# EAGLE board OASIS-Board (EAGLE 9.6.2)
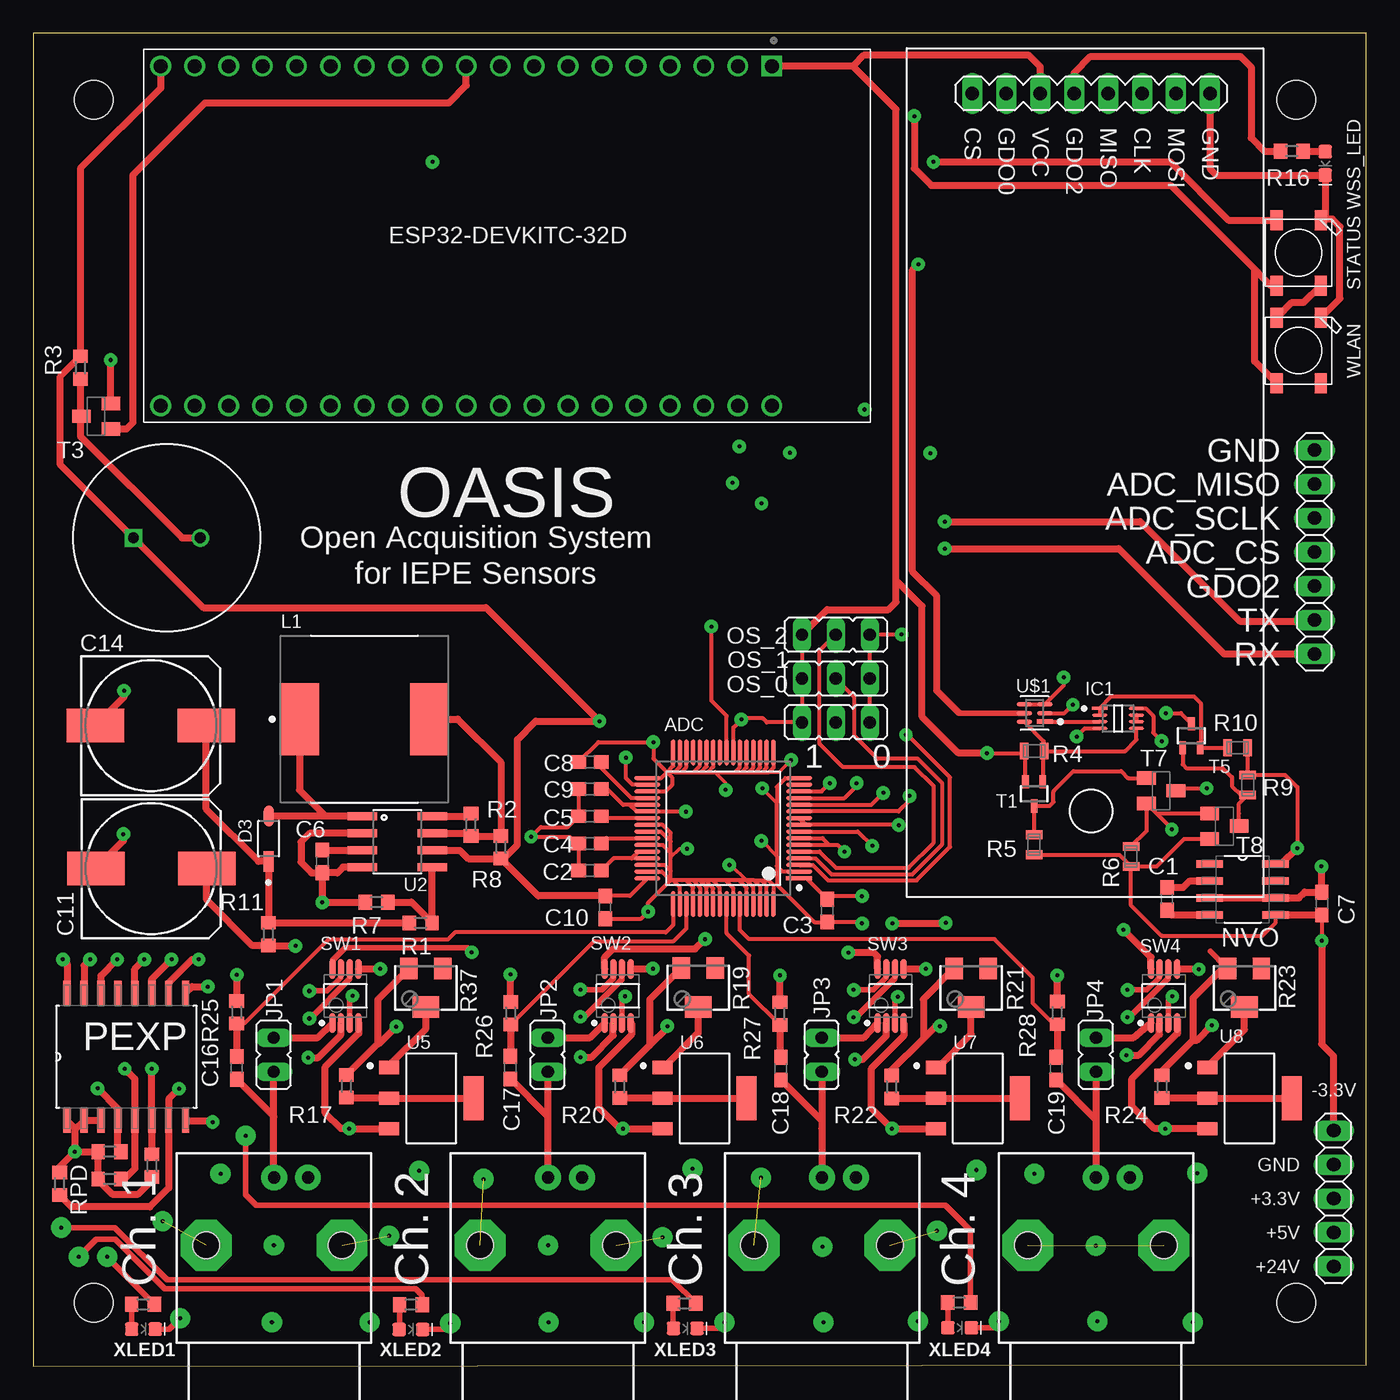
[diagram p2: board, top side]
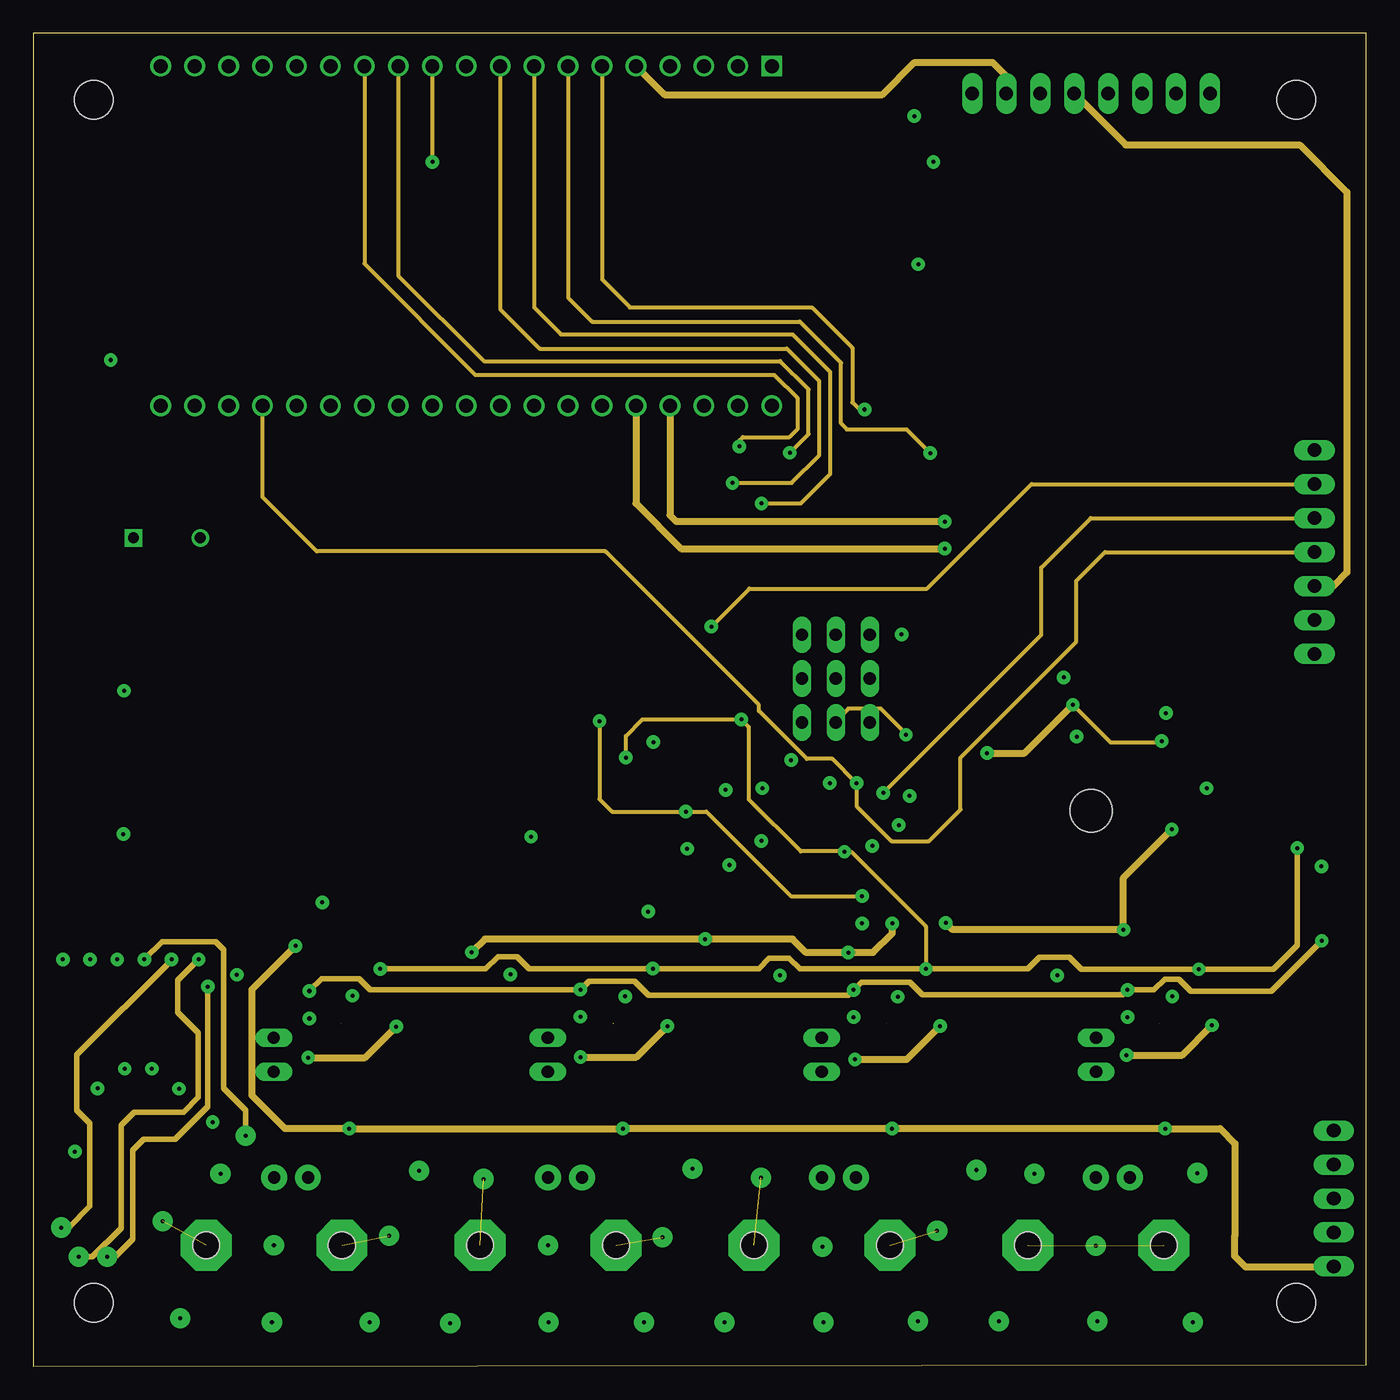
[diagram p3: board, inner layer Route2]
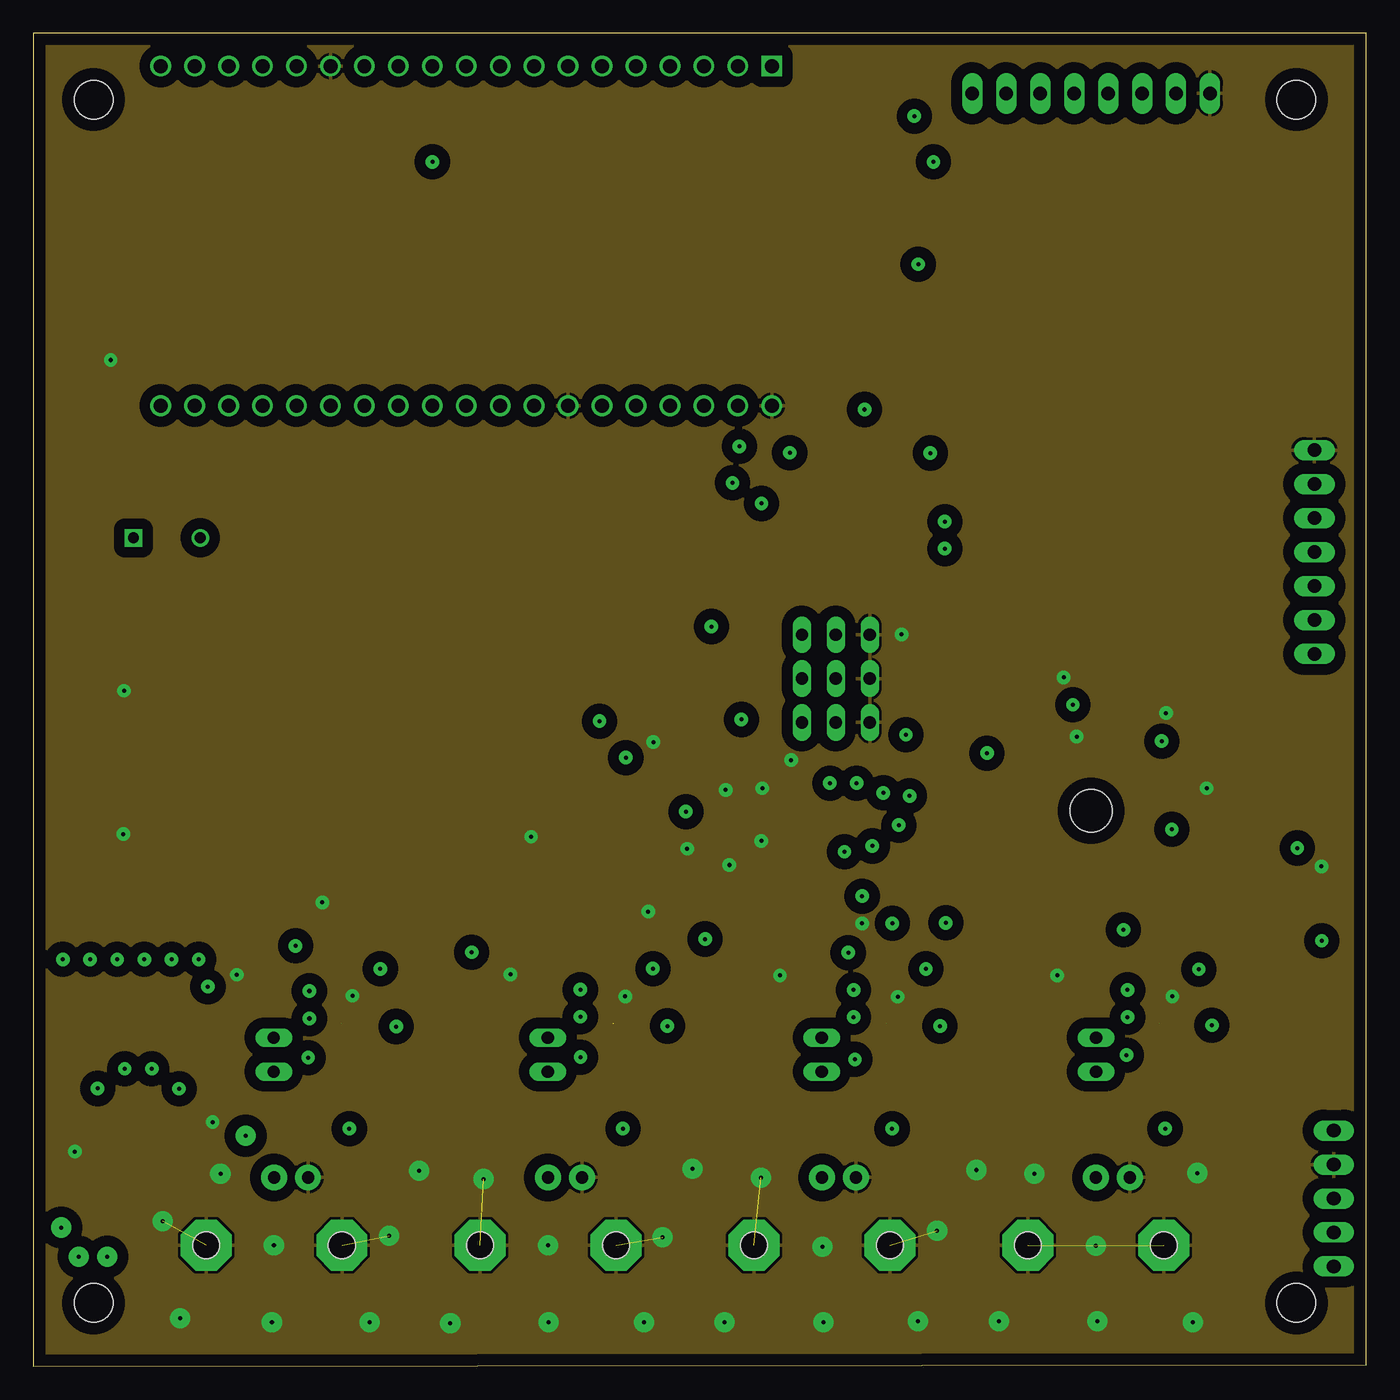
[diagram p4: board, inner layer Ground]
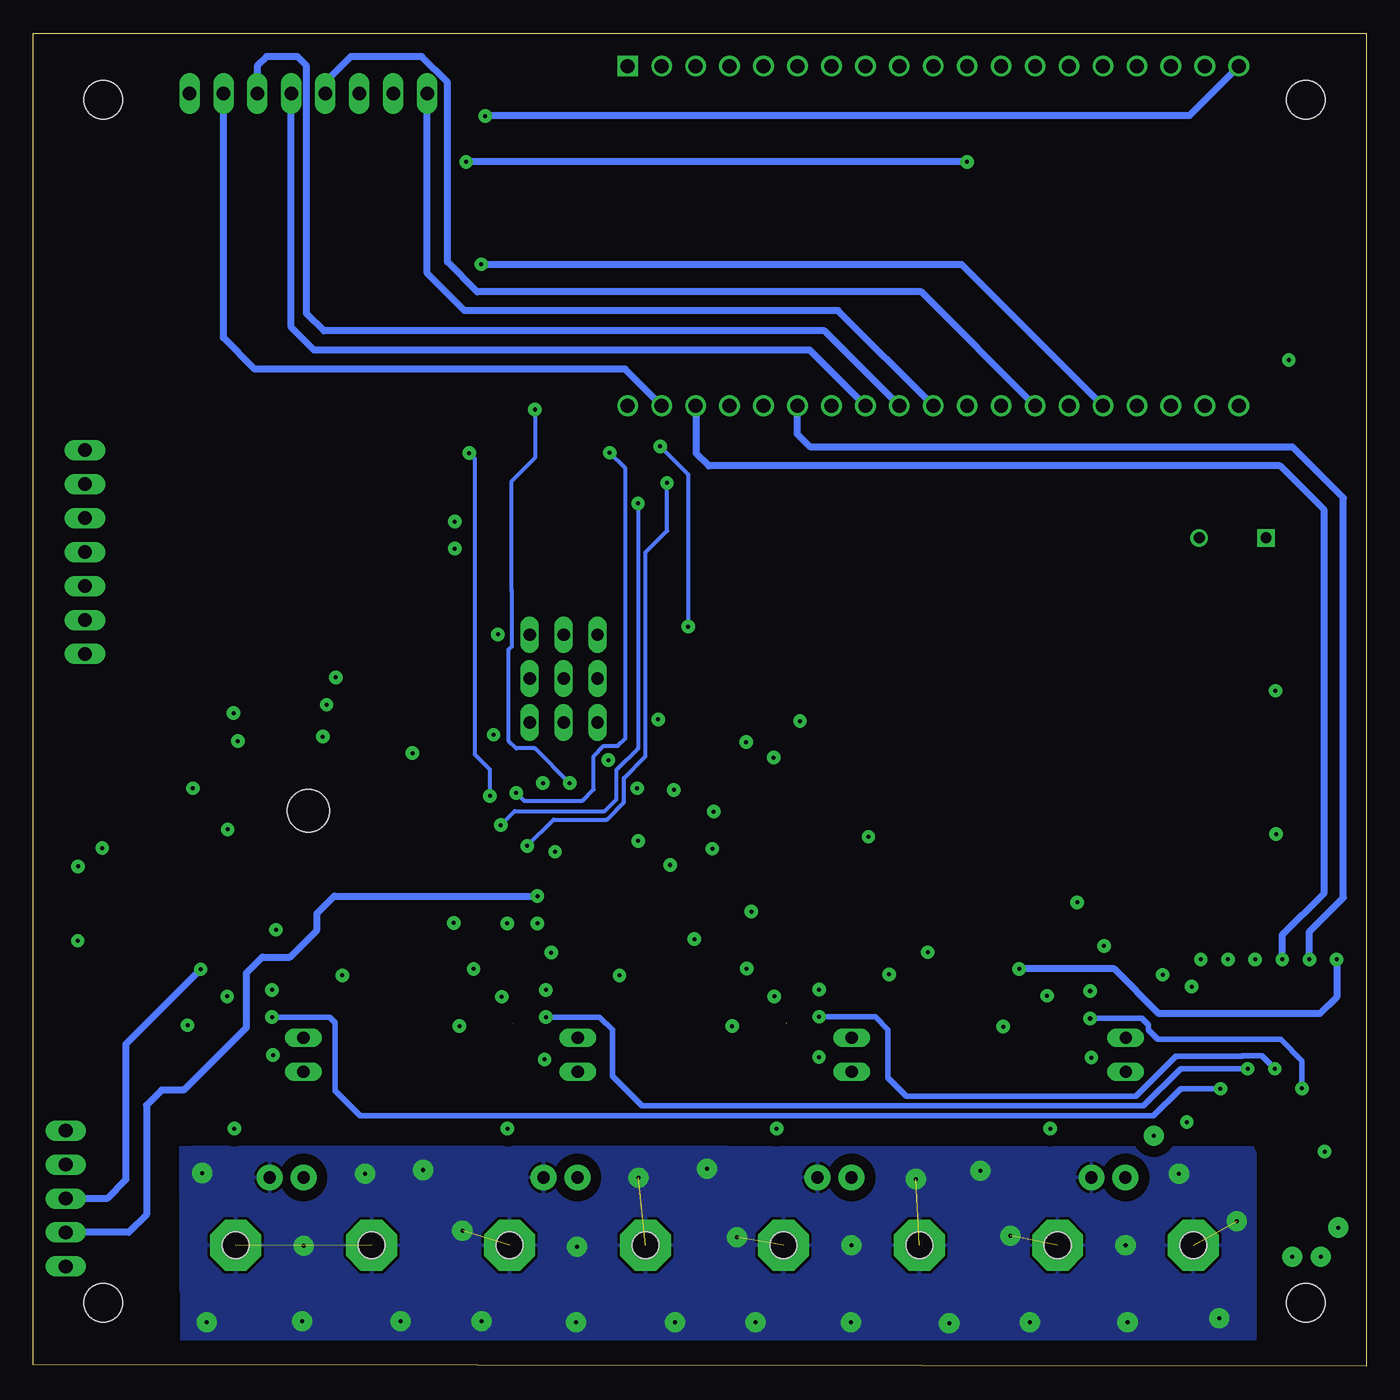
[diagram p5: board, bottom side, seen from below]

Size 99.71 x 99.69 mm. Coordinates in mm from the lower left corner, seen from the top.
Outline: 0,0 99.71,0.12 99.71,99.69 0,99.69 0,0
Copper layers (1*2+3*16): Top 0.035mm / dielectric 0.15mm / Route2 0.035mm / dielectric 0.15mm / Ground 0.035mm / dielectric 0.15mm / Bottom 0.035mm
Design rules "default *": minimum track width 5mil, minimum drill 0.15mm, track to track 4mil, track to pad 4mil, pad to pad 4mil, via to via 4mil, smd to smd 4mil, copper to edge 35mil, drill to drill 10mil, minimum pad ring 5mil, minimum via ring 5mil, stop-mask expansion 8mil, vias tented up to drill 5mil, thermal gap 8mil
Net classes: 1 gnd: width 0.254 mm, drill 0.254 mm, clearance 0.178 mm
Holes 2.9 mm at 94.5,4.74 94.5,94.74 4.5,4.74 4.5,94.74
Holes 3.17 mm at 79.13,41.55

## Footprints (pad centres in the part's own frame; a part is rotated, then mirrored left to right if it is on the bottom)
ANALOG_DEVICES_AD7606-4_0 = smd 1.955 x 0.312: 1 -5.675,3.75; 2 -5.675,3.25; 3 -5.675,2.75; 4 -5.675,2.25; 5 -5.675,1.75; 6 -5.675,1.25; 7 -5.675,0.75; 8 -5.675,0.25; 9 -5.675,-0.25; 10 -5.675,-0.75; 11 -5.675,-1.25; 12 -5.675,-1.75; 13 -5.675,-2.25; 14 -5.675,-2.75; 15 -5.675,-3.25; 16 -5.675,-3.75; 33 5.675,-3.75; 34 5.675,-3.25; 35 5.675,-2.75; 36 5.675,-2.25; 37 5.675,-1.75; 38 5.675,-1.25; 39 5.675,-0.75; 40 5.675,-0.25; 41 5.675,0.25; 42 5.675,0.75; 43 5.675,1.25; 44 5.675,1.75; 45 5.675,2.25; 46 5.675,2.75; 47 5.675,3.25; 48 5.675,3.75 | smd 0.312 x 1.955: 17 -3.75,-5.675; 18 -3.25,-5.675; 19 -2.75,-5.675; 20 -2.25,-5.675; 21 -1.75,-5.675; 22 -1.25,-5.675; 23 -0.75,-5.675; 24 -0.25,-5.675; 25 0.25,-5.675; 26 0.75,-5.675; 27 1.25,-5.675; 28 1.75,-5.675; 29 2.25,-5.675; 30 2.75,-5.675; 31 3.25,-5.675; 32 3.75,-5.675; 49 3.75,5.675; 50 3.25,5.675; 51 2.75,5.675; 52 2.25,5.675; 53 1.75,5.675; 54 1.25,5.675; 55 0.75,5.675; 56 0.25,5.675; 57 -0.25,5.675; 58 -0.75,5.675; 59 -1.25,5.675; 60 -1.75,5.675; 61 -2.25,5.675; 62 -2.75,5.675; 63 -3.25,5.675; 64 -3.75,5.675
C0603 = smd 1.1 x 1: 1 -0.85,0; 2 0.85,0
153CLV-1012 = smd 4.3 x 2.5: + 4.15,0; - -4.15,0
DIODES_1N5819HW-7-F_1 = smd 1.557 x 0.742: 1 -1.7,0; 2 1.7,0
TEXAS_INSTRUMENTS_SN74LVC2G00DCUT_2 = smd 1.16 x 0.237: 1 -1.376,0.75; 2 -1.376,0.25; 3 -1.376,-0.25; 4 -1.376,-0.75; 5 1.376,-0.75; 6 1.376,-0.25; 7 1.376,0.25; 8 1.376,0.75
JP1 = drill 0.914 long: 1 0,-1.27; 2 0,1.27
1X05 = drill 1.016 long: 1 -5.08,0; 2 -2.54,0; 3 0,0; 4 2.54,0; 5 5.08,0
1X07 = drill 1.016 long: 1 -7.62,0; 2 -5.08,0; 3 -2.54,0; 4 0,0; 5 2.54,0; 6 5.08,0; 7 7.62,0
BOURNS_SRR1260-470M_0 = smd 2.9 x 5.4: 1 -4.85,0; 2 4.85,0
TDK_PS1420P02CT_0 = drill 0.8 pad 1.3 square: 1 -2.5,0 | drill 0.8 pad 1.3: 2 2.5,0
SOIC127P600X175-8N = smd 1.981 x 0.559: 1 -2.464,1.905; 2 -2.464,0.635; 3 -2.464,-0.635; 4 -2.464,-1.905; 5 2.464,-1.905; 6 2.464,-0.635; 7 2.464,0.635; 8 2.464,1.905
JP2 = drill 0.914 long: 1 -2.54,0; 2 0,0; 3 2.54,0
SOIC127P1032X265-16N = smd 1.803 x 0.533: 1 -4.775,4.445; 2 -4.775,3.175; 3 -4.775,1.905; 4 -4.775,0.635; 5 -4.775,-0.635; 6 -4.775,-1.905; 7 -4.775,-3.175; 8 -4.775,-4.445; 9 4.775,-4.445; 10 4.775,-3.175; 11 4.775,-1.905; 12 4.775,-0.635; 13 4.775,0.635; 14 4.775,1.905; 15 4.775,3.175; 16 4.775,4.445
R0603 = smd 1 x 1.1: 1 -0.85,0; 2 0.85,0
R0603_MAYR = smd 0.65 x 1.25: 1 -0.75,0; 2 0.75,0
SM-42/43W = smd 1.3 x 1.6: 1 -1.27,-1.45; 3 1.27,-1.45 | smd 2 x 1.6: 2 0,1.45
WS2812B = smd 1.5 x 0.9: 1-VDD 2.45,-1.65; 2-DOUT 2.45,1.65; 3-GND -2.45,1.65; 4-DIN -2.45,-1.65
MA08-1 = drill 1.016 long: 1 -8.89,0; 2 -6.35,0; 3 -3.81,0; 4 -1.27,0; 5 1.27,0; 6 3.81,0; 7 6.35,0; 8 8.89,0
ANALOG_DEVICES_ADG419BRMZ_0 = smd 1.5 x 0.45: 1 -2.025,0.975; 2 -2.025,0.325; 3 -2.025,-0.325; 4 -2.025,-0.975; 5 2.025,-0.975; 6 2.025,-0.325; 7 2.025,0.325; 8 2.025,0.975
SOT323 = smd 0.5 x 1: 1 0,0.9; 2 -0.65,-0.9; 3 0.65,-0.9
SOT23-BEC = smd 1 x 1.4: B -0.95,-1.1; C 0,1.1; E 0.95,-1.1
SOT23 = smd 1 x 1.4: 1 -0.95,-1.1; 2 0.95,-1.1; 3 0,1.1
SO08 = smd 0.61 x 2.21: 1 -1.905,-2.616; 2 -0.635,-2.616; 3 0.635,-2.616; 4 1.905,-2.616; 5 1.905,2.616; 6 0.635,2.616; 7 -0.635,2.616; 8 -1.905,2.616
MODULE_ESP32-DEVKITC-32D = drill 1.04 square: 1 -12.7,19.76 | drill 1.04: 2 -12.7,17.22; 3 -12.7,14.68; 4 -12.7,12.14; 5 -12.7,9.6; 6 -12.7,7.06; 7 -12.7,4.52; 8 -12.7,1.98; 9 -12.7,-0.56; 10 -12.7,-3.1; 11 -12.7,-5.64; 12 -12.7,-8.18; 13 -12.7,-10.72; 14 -12.7,-13.26; 15 -12.7,-15.8; 16 -12.7,-18.34; 17 -12.7,-20.88; 18 -12.7,-23.42; 19 -12.7,-25.96; 20 12.7,19.76; 21 12.7,17.22; 22 12.7,14.68; 23 12.7,12.14; 24 12.7,9.6; 25 12.7,7.06; 26 12.7,4.52; 27 12.7,1.98; 28 12.7,-0.56; 29 12.7,-3.1; 30 12.7,-5.64; 31 12.7,-8.18; 32 12.7,-10.72; 33 12.7,-13.26; 34 12.7,-15.8; 35 12.7,-18.34; 36 12.7,-20.88; 37 12.7,-23.42; 38 12.7,-25.96
ANALOG_DEVICES_INC_LT3092IST#PBF_0 = smd 1.499 x 0.991: 1 -3.15,2.286; 2 -3.15,0; 3 -3.15,-2.286 | smd 1.499 x 3.277: 4 3.15,0
TEXAS_INSTRUMENTS_TMUX1119DCKR_3 = smd 1.164 x 0.336: 1 -0.77,0.65; 2 -0.77,0; 3 -0.77,-0.65; 4 0.77,-0.65; 5 0.77,0; 6 0.77,0.65
LED-0603 = smd 1 x 1: A -0.877,0; C 0.877,0
AMP_227161 = drill 0.9 pad 1.93: 1 0,-5.08; 2 -2.54,-5.08 | drill 2.05 pad 3.81 octagon: P$1 -5.08,0; P$2 5.08,0 | hole 2: -5.08,0; 5.08,0

## Placement (x,y rotation side)
ADC  ANALOG_DEVICES_AD7606-4ANALOG_DEVICES_AD7606-4_0_0  [ANALOG_DEVICES_AD7606-4_0]  51.61,40.25 180 top
C1  10u  [C0603]  84.81,34.96 90 top
C2  10u  [C0603]  41.63,37.07 0 top
C3  100n  [C0603]  59.4,34.07 90 top
C4  10u  [C0603]  41.63,39.1 0 top
C5  1u  [C0603]  41.63,41.13 0 top
C6  680p  [C0603]  21.62,37.76 270 top
C7  10u  [C0603]  96.39,34.61 270 top
C8  1u  [C0603]  41.63,45.2 0 top
C9  100n  [C0603]  41.63,43.17 0 top
C10  100n  [C0603]  42.77,34.33 90 top
C11  220µF  [153CLV-1012]  8.81,37.22 0 top
C14  220µF  [153CLV-1012]  8.79,47.92 0 top
C16  10u  [C0603]  15.21,22.31 90 top
C17  10u  [C0603]  35.69,22.34 90 top
C18  10u  [C0603]  55.93,22.26 90 top
C19  10u  [C0603]  76.53,22.26 90 top
D3  DIODES_1N5819HW-7-FDIODES_1N5819HW-7-F_0_1  [DIODES_1N5819HW-7-F_1]  17.6,39.46 90 top
IC1  74LVC2G00  [TEXAS_INSTRUMENTS_SN74LVC2G00DCUT_2]  81.15,48.46 0 top
JP1  [JP1]  17.98,23.3 180 top
JP2  [JP1]  38.48,23.3 180 top
JP3  [JP1]  58.98,23.3 180 top
JP4  [JP1]  79.5,23.3 180 top
JP5  [1X05]  97.29,12.55 270 top
JP6  [1X07]  95.84,60.9 270 top
L1  BOURNS_SRR1260-470MBOURNS_SRR1260-470M_0_0  [BOURNS_SRR1260-470M_0]  24.77,48.4 0 top
LS1  TDK_PS1420P02CTTDK_PS1420P02CT_0_0  [TDK_PS1420P02CT_0]  9.98,61.96 0 top
NVO  ICL7660CBAZ  [SOIC127P600X175-8N]  90.47,35.67 0 top
OS_0  [JP2]  60.03,48.16 0 top
OS_1  [JP2]  60.03,51.43 0 top
OS_2  [JP2]  60.03,54.71 0 top
PEXP  PCA9554AD,118  [SOIC127P1032X265-16N]  6.96,23.15 90 top
R1  40k  [R0603]  28.98,33.16 0 top
R2  220  [R0603]  32.74,40.5 270 top
R3  1k  [R0603]  3.52,74.69 90 top
R4  10k  [R0603_MAYR]  74.87,46.02 180 top
R5  10k  [R0603_MAYR]  74.87,39.01 90 top
R6  2k0  [R0603_MAYR]  82.12,38.13 90 top
R7  2.2k  [R0603]  25.68,34.71 180 top
R8  1.5  [R0603]  34.98,38.82 90 top
R9  10k  [R0603_MAYR]  90.85,43.48 90 top
R10  10k  [R0603_MAYR]  90.09,46.26 0 top
R11  220  [R0603]  17.58,32.32 90 top
R12  470  [R0603]  8.2,4.63 0 top
R13  470  [R0603]  28.24,4.61 0 top
R14  470  [R0603]  48.72,4.71 0 top
R15  470  [R0603]  69.27,4.76 0 top
R16  470  [R0603]  94.15,90.88 180 top
R17  20  [R0603]  23.42,20.94 90 top
R19  20k  [SM-42/43W]  49.73,28.33 180 top
R20  20  [R0603]  43.87,20.92 90 top
R21  20k  [SM-42/43W]  70.15,28.31 180 top
R22  20  [R0603]  64.21,20.89 90 top
R23  20k  [SM-42/43W]  90.6,28.31 180 top
R24  20  [R0603]  84.43,20.92 90 top
R25  20k  [R0603]  15.21,26.48 270 top
R26  20k  [R0603]  35.71,26.4 270 top
R27  20k  [R0603]  55.85,26.38 270 top
R28  20k  [R0603]  76.61,26.43 270 top
R37  20k  [SM-42/43W]  29.36,28.31 180 top
RPD  10k  [R0603]  1.96,13.65 270 top
RPD1  10k  [R0603]  8.88,15 90 top
RPD2  10k  [R0603]  5.7,14.01 0 top
RPD3  10k  [R0603]  5.7,16.05 0 top
STATUS  WS2812B5050  [WS2812B]  94.66,83.28 270 top
SV1  [MA08-1]  79.14,95.2 0 top
SW1  ANALOG_DEVICES_ADG419BRMZANALOG_DEVICES_ADG419BRMZ_0_0  [ANALOG_DEVICES_ADG419BRMZ_0]  23.34,27.7 90 top
SW2  ANALOG_DEVICES_ADG419BRMZANALOG_DEVICES_ADG419BRMZ_0_0  [ANALOG_DEVICES_ADG419BRMZ_0]  43.71,27.7 90 top
SW3  ANALOG_DEVICES_ADG419BRMZANALOG_DEVICES_ADG419BRMZ_0_0  [ANALOG_DEVICES_ADG419BRMZ_0]  64.14,27.7 90 top
SW4  ANALOG_DEVICES_ADG419BRMZANALOG_DEVICES_ADG419BRMZ_0_0  [ANALOG_DEVICES_ADG419BRMZ_0]  84.58,27.7 90 top
T1  BSS84SOT323  [SOT323]  74.87,42.82 180 top
T3  [SOT23-BEC]  4.69,71.06 90 top
T5  BSS84SOT323  [SOT323]  86.64,47.16 0 top
T7  BSS123  [SOT23]  84.37,43.05 270 top
T8  BSS123  [SOT23]  89.1,40.4 270 top
U2  MC34063SMD  [SO08]  27.23,39.23 270 top
U4  ESP32-DEVKITC-32D  [MODULE_ESP32-DEVKITC-32D]  35.48,84.54 270 top
U5  ANALOG_DEVICES_INC_LT3092IST#PBFANALOG_DEVICES_INC_LT3092IST#PBF_0_0  [ANALOG_DEVICES_INC_LT3092IST#PBF_0]  29.77,20.05 0 top
U6  ANALOG_DEVICES_INC_LT3092IST#PBFANALOG_DEVICES_INC_LT3092IST#PBF_0_0  [ANALOG_DEVICES_INC_LT3092IST#PBF_0]  50.22,20.05 0 top
U7  ANALOG_DEVICES_INC_LT3092IST#PBFANALOG_DEVICES_INC_LT3092IST#PBF_0_0  [ANALOG_DEVICES_INC_LT3092IST#PBF_0]  70.66,20.05 0 top
U8  ANALOG_DEVICES_INC_LT3092IST#PBFANALOG_DEVICES_INC_LT3092IST#PBF_0_0  [ANALOG_DEVICES_INC_LT3092IST#PBF_0]  90.98,20.05 0 top
U$1  TMUX1119  [TEXAS_INSTRUMENTS_TMUX1119DCKR_3]  74.9,48.86 180 top
WLAN  WS2812B5050  [WS2812B]  94.66,75.96 270 top
WSS_LED  [LED-0603]  96.66,89.97 270 top
X1  BNC  [AMP_227161]  18,9.04 180 top
X2  BNC  [AMP_227161]  38.5,9.04 180 top
X3  BNC  [AMP_227161]  59,9.04 180 top
X4  BNC  [AMP_227161]  79.5,9.04 180 top
XLED1  [LED-0603]  8.23,2.78 0 top
XLED2  [LED-0603]  28.24,2.75 0 top
XLED3  [LED-0603]  48.77,2.83 0 top
XLED4  [LED-0603]  69.29,2.88 0 top

## Tracks (layer width: path | path; a pad name or v marks a point on that pad's centre or on a via)
5V  (via drill 0.3 pad 1)
  Top 0.305: ADC.1 57.83,36.5 C3.2 59.64,35.17 v62.01,35.17 | ADC.48 44.62,35.18 C10.2 | C9.2 42.95,43.17 44.12,42 44.6,42 | 44.6,42 45.1,41.5 ADC.38 48.8,41.5 v48.82,41.48 | ADC.37 44.6,42
  Top 0.508: U2.6 31.9,38.59 32.52,37.97 R8.1 | R8.1 37.77,35.18 C10.2 | U4.19 9.52,95.6 3.52,89.6 R3.2 2.02,74.04 2.02,67.42 LS1.1 12.7,56.74 33.86,56.74 v42.35,48.25 37.59,48.25 36.21,46.87 36.21,39.01 35.18,37.97 R8.1 | WLAN.1-VDD 91.36,75.16 91.36,82.06 | v65.91,93.5 65.91,89.59 67.17,88.33 85.1,88.33 91.36,82.06 | 91.36,82.06 91.99,81.43 91.99,81.41 92.58,80.83 STATUS.1-VDD
  Route2 0.305: v42.35,48.25 42.35,42.42 43.29,41.48 v48.82,41.48 50.35,41.48 56.66,35.17 v62.01,35.17
  Bottom 0.508: JP5.4 92.59,10.01 91.25,11.35 91.25,19.54 90.13,20.66 88.45,20.66 83.76,25.35 83.76,29.42 82.58,30.61 80.5,30.61 78.49,32.62 78.49,33.88 77.2,35.17 v62.01,35.17 | U4.19 13.22,93.55 65.87,93.55 v65.91,93.5
+3V3  (via drill 0.3 pad 1)
  Top 0.305: v60.68,38.48 60.16,39 59.54,39 | ADC.34 44.81,43.5 44.32,43.98 v44.32,45.52 | ADC.23 52.36,47.77 v52.97,48.38 53.05,48.45 54.58,48.45 54.88,48.16 OS_0.1 OS_1.1 OS_2.1 | ADC.6 59.54,39 | ADC.7 59.04,39.5 59.54,39 | v71.35,45.86 73.96,45.86 R4.2 74.22,45.92 T1.3 | U$1.2 77.14,48.86 v77.77,49.48 | R10.2 90.84,44.25 R9.2 93.64,44.23 94.56,43.31 v94.56,38.76 | IC1.8 83.22,49.21 83.78,48.65 83.78,47.39 v84.42,46.76
  Top 0.406: 93.38,37.58 NVO.8
  Top 0.508: v2.21,30.43 2.52,30.12 PEXP.16 | SW4.5 87.19,29.72 87.2,29.72 v87.2,29.69 | SW1.5 v25.95,29.72 v25.96,29.72 | SW3.5 v66.77,29.72 | SW2.5 46.33,29.72 v46.35,29.74 | v94.56,38.76 93.38,37.58 | OS_2.1 59.37,56.59 63.97,56.59 64.54,57.16 64.54,58.8 | 64.54,58.8 64.54,94 61.3,97.24 | 61.3,97.24 U4.1 | SV1.3 75.33,97.2 74.49,98.04 62.1,98.04 61.3,97.24 | v71.35,45.86 69.21,45.86 66.48,48.59 66.48,56.86 64.54,58.8
  Route2 0.305: v44.32,45.52 44.32,47.13 45.56,48.38 v52.97,48.38 53.52,47.83 53.52,42.4 57.41,38.51 60.65,38.51 v60.68,38.48 61.2,38.48 66.77,32.91 v66.77,29.72 | v77.77,49.48 80.58,46.66 84.32,46.66 v84.42,46.76
  Route2 0.406: v94.56,38.76 94.56,31.48 92.78,29.69 v87.2,29.69 78.42,29.69 77.52,30.59 75.26,30.59 74.39,29.72 v66.77,29.72 57.34,29.72 56.54,30.52 55.04,30.52 54.27,29.74 v46.35,29.74 37.07,29.74 36.2,30.62 34.75,30.62 33.85,29.72 v25.96,29.72
  Route2 0.508: v71.35,45.86 74.15,45.86 v77.77,49.48
  Bottom 0.406: 94.56,38.79 v94.56,38.76
  Bottom 0.508: v2.21,30.43 2.21,27.62 3.45,26.38 15.51,26.38 18.85,29.72 v25.96,29.72 | v87.2,29.69 92.79,24.1 92.79,13.96 94.2,12.55 JP5.3
+24V  (via drill 0.3 pad 1)
  Top 0.305: SW2.4 44.73,25.67 | SW4.4 85.56,25.89 85.59,25.93 | SW3.4 | SW1.4 24.34,25.67
  Top 0.508: C11.+ 12.96,34.88 16.38,31.47 R11.1 19.58,31.47 v19.61,31.45 | U5.3 v23.64,17.77 23.01,17.77 21.84,18.93 21.84,22.39 24.34,24.89 24.34,25.67 | 85.59,25.93 85.59,24.9 82.19,21.51 82.19,19.44 83.87,17.77 v84.67,17.77 U8.3 | 44.73,25.67 44.73,24.78 42.29,22.34 42.29,19.36 43.88,17.77 v44.11,17.77 U6.3 | SW3.4 65.12,24.7 62.71,22.3 62.71,19.31 v64.25,17.77 U7.3
  Route2 0.508: v19.61,31.45 16.33,28.17 16.33,20.25 18.82,17.77 v23.64,17.77 v44.11,17.77 v64.25,17.77 v84.67,17.77 88.79,17.77 89.9,16.66 89.9,9.77 89.86,9.73 89.86,8.26 90.68,7.44 97.26,7.44 JP5.5
CH1+
  Top 0.305: R25.2 15.77,25.63 22.04,31.9 30.99,31.9 31.55,32.45 47.33,32.45 47.86,32.99 ADC.49
  Top 0.508: R25.2 C16.2
CH2+
  Top 0.305: ADC.51 48.85,34.56 48.85,32.76 47.89,31.8 41.96,31.8 R26.2
  Top 0.508: R26.2 35.71,23.21 C17.2
CH3+
  Top 0.305: ADC.57 51.86,32.4 53.54,30.72 53.54,27.84 R27.2
  Top 0.508: R27.2 55.85,23.19 C18.2
CH4+
  Top 0.305: 76.61,25.33 74.78,27.16 74.78,29.07 71.9,31.95 55.68,31.95 55.68,31.94 53.54,31.94 52.86,32.62 ADC.59
  Top 0.508: R28.2 76.61,25.33 76.61,23.19 C19.2
GND  (via drill 0.3 pad 1, 0.3 pad 1.5)  (8 unrouted)
  Top 0.254: 6.78,50.56 v6.78,50.52 | 47.68,38.06 48.33,38.71 v48.92,38.71 | v52.07,37.49 52.21,37.49 53.37,36.33 | 55.63,38.16 54.49,39.3 v54.45,39.3 | 51,44.44 51.79,43.65 v51.79,43.11 | 55.63,42.1 54.53,43.19 v54.53,43.23 | 55.04,44.44 55.79,44.44 v56.69,45.34 | 6.73,39.84 v6.73,39.8
  Top 0.305: ADC.50 48.36,35.83 47.86,36.33 | ADC.52 49.36,35.81 48.84,36.33 | ADC.54 50.36,35.82 49.85,36.33 | ADC.56 51.36,35.8 50.83,36.33 | ADC.58 52.36,35.76 51.79,36.33 | ADC.60 53.36,35.77 52.8,36.33 | 55.63,37.43 55.63,38.16 55.63,42.1 55.63,43.34 56.27,43.98 57.27,43.98 ADC.16 | 53.92,36.33 53.37,36.33 | 53.37,36.33 52.8,36.33 | 52.8,36.33 51.79,36.33 | 51.79,36.33 50.83,36.33 | 50.83,36.33 50.27,36.33 | 50.27,36.33 49.85,36.33 | 49.85,36.33 49.35,36.33 | 49.35,36.33 48.84,36.33 | 48.84,36.33 47.86,36.33 | C10.1 45.46,33.48 v46,34.01 46,34.66 47.68,36.33 | 53.92,36.33 54.36,35.9 ADC.62 | 47.86,36.33 47.68,36.33 | 53.92,36.33 54.46,36.33 | 54.46,36.33 54.99,36.33 55.36,35.96 ADC.64 | 55.63,37.43 55.63,36.03 58.43,33.22 C3.1 61.91,33.22 v62.01,33.13 | 40.76,37.09 C2.1 40.78,38.95 | C9.1 C5.1 39.97,40.32 37.96,40.32 v37.23,39.6 40.13,39.6 40.78,38.95 | ADC.35 47.3,43 47.78,43.47 47.78,44.05 47.4,44.44 | 47.4,44.44 46.95,44 ADC.33 | 47.95,44.44 47.4,44.44 | 47.4,44.44 47.86,44.9 ADC.32 | ADC.31 48.36,44.84 47.95,44.44 | 47.95,44.44 48.49,44.44 | 48.49,44.44 49.4,44.44 | 49.4,44.44 49.94,44.44 | 49.94,44.44 50.47,44.44 | 50.47,44.44 51,44.44 52.5,44.44 | 52.5,44.44 53.01,44.44 | 53.01,44.44 53.52,44.44 | 53.52,44.44 54.03,44.44 | 54.03,44.44 54.53,44.44 | 54.53,44.44 55.04,44.44 55.37,44.77 55.37,45.91 ADC.17 | 54.53,44.44 54.86,44.77 ADC.18 | 54.03,44.44 54.36,44.77 ADC.19 | 53.52,44.44 53.86,44.78 ADC.20 | 53.01,44.44 53.36,44.79 ADC.21 | 52.5,44.44 52.86,44.8 ADC.22 | ADC.26 50.86,44.83 50.47,44.44 | 49.94,44.44 50.36,44.86 ADC.27 | 49.4,44.44 49.86,44.9 ADC.28 | 48.49,44.44 48.86,44.81 ADC.30 | 47.4,44.44 46.38,45.45 v46.38,46.69 42.27,46.69 C8.1
  Top 0.305: ADC.2 56.06,37 55.63,37.43 | 47.68,36.33 47.68,37.05 | 47.68,37.05 47.68,38.06 47.68,38.39 | 47.68,38.39 47.68,39.25 | 47.68,39.25 47.68,39.89 47.07,40.5 ADC.40 | 47.68,39.25 47.24,39.69 47.24,39.7 46.95,40 ADC.41 | ADC.43 47.07,39 47.68,38.39 | ADC.47 47.01,37 47.68,36.33 | ADC.46 47.23,37.5 47.68,37.05 | 49.35,36.33 49.86,35.82 ADC.53 | ADC.55 50.86,35.74 50.27,36.33 | ADC.61 53.86,35.84 53.37,36.33 | ADC.63 54.86,35.93 54.46,36.33 | C4.1 40.78,38.95 | OS_0.3 OS_1.3 OS_2.3 64.96,54.71 v64.96,54.74 | U$1.4 U$1.3 77.09,50.92 77.08,50.93 v77.08,51.52 | v78.05,47.1 78.66,47.71 IC1.4 | v84.74,48.85 85.85,48.85 T5.1 | T7.3 85.66,43.23 v87.79,43.23
  Top 0.406: SW1.3 23.67,27.51 v23.87,27.71 | SW2.3 44.04,27.43 v44.27,27.66 | SW3.3 64.46,27.43 v64.67,27.64 | SW4.3 84.91,27.35 v85.22,27.66 | XLED4.C 71.77,2.88 v72.24,3.36 | XLED3.C 51.22,2.83 v51.69,3.3 | XLED2.C 30.74,2.75 v31.19,3.21 | XLED1.C 10.17,2.78 v10.97,3.58
  Top 0.508: C14.- 4.66,47.89 | U2.2 20.65,39.86 20.02,39.23 20.02,37.71 20.81,36.91 C6.2 | U2.4 23.16,37.32 22.75,36.91 C6.2 | C6.2 v21.61,34.7 24.82,34.7 R7.2 | C14.- 4.64,48.67 | 15.21,27.35 R25.1 v15.21,29.29 | T3.E 5.79,75.25 v5.78,75.26 | R28.1 v76.61,29.23 v76.6,29.24 | R27.1 v55.85,29.23 v55.85,29.24 | R26.1 35.71,29.29 v35.69,29.31 | C14.- 6.78,50.06 6.78,50.56 | v6.73,39.8 6.73,39.29 C11.- | NVO.3 NVO.6 94.69,35.04 95.11,35.46 C7.1 96.36,35.48 v96.36,37.39 | PEXP.8 13.3,18.38 v13.41,18.26 | 3.1,17.69 PEXP.2 PEXP.3 | 3.1,17.69 v3.1,16.05 | PEXP.1 3.1,17.79 3.1,17.69 | SV1.8 88.03,89.56 88.51,89.09 WSS_LED.C 96.66,86.08 96.37,85.79 | 96.37,85.79 STATUS.3-GND | WLAN.3-GND 97.75,79.85 97.75,85.24 97.19,85.79 96.37,85.79 | RPD.1 1.96,14.92 v3.1,16.05 | v3.1,16.05 RPD3.1 RPD2.1 4.85,13.93 5.94,12.83 7.79,12.83 8.88,13.92 RPD1.1
  other vias: 17.84,3.3 25.14,3.3 38.54,3.3 45.69,3.3 59.09,3.3 66.19,3.36 79.59,3.36 86.74,3.3 67.62,10.14 70.56,14.68 47.07,9.64 49.3,14.77 26.62,9.76 28.85,14.64 9.67,10.86 17.99,9.05 13.99,14.4 33.69,14.01 54.44,14.11 74.89,14.4 38.49,9.05 59.04,8.96 79.49,9.01 87.09,14.46
  pour Ground (isolate 0.813): 0,99.74 99.5,99.74 99.5,0.24 0,0.24
  pour Bottom (isolate 0.813): 8.45,16.39 87.1,16.44 88.75,16.39 88.7,1.99 87.1,2.04 8.25,2.04 8.25,15.94
ICP1  (via drill 0.3 pad 1)  (1 unrouted)
  Top 0.508: R37.3 25.76,27.42 25.76,24.13 | 25.76,24.13 R17.2 | v20.55,23.09 21.3,23.09 23.01,24.8 SW1.2 | 25.76,24.13 25.86,24.13 v27.14,25.41
  Route2 0.508: v20.55,23.09 24.82,23.09 v27.14,25.41
ICP2  (via drill 0.3 pad 1)  (1 unrouted)
  Top 0.508: R19.3 46.1,27.42 46.1,24 | R20.2 46.1,24 | v40.93,23.12 41.76,23.12 43.38,24.74 SW2.2 | 46.1,24 47.43,25.33 v47.43,25.45
  Route2 0.508: v40.93,23.12 45.11,23.12 v47.43,25.45
ICP3  (via drill 0.3 pad 1)  (1 unrouted)
  Top 0.508: R21.3 66.57,27.45 66.57,24.51 | 66.57,24.51 64.21,22.15 R22.2 | v61.47,22.95 62.05,22.95 63.8,24.7 SW3.2 | 66.57,24.51 67.51,25.45 v67.83,25.45
  Route2 0.508: v61.47,22.95 65.34,22.95 v67.83,25.45
ICP4  (via drill 0.3 pad 1)  (1 unrouted)
  Top 0.406: 88.04,31.02 89.26,29.81 89.26,29.76
  Top 0.508: 86.75,24.39 84.43,22.07 R24.2 | 86.75,24.39 86.75,27.53 88.98,29.76 89.26,29.76 R23.3 | v81.78,23.28 82.7,23.28 84.25,24.83 SW4.2 | 86.75,24.39 87.07,24.39 v88.18,25.5
  Route2 0.508: v81.78,23.28 85.95,23.28 v88.18,25.5
IO2  (via drill 0.3 pad 1)
  Top 0.406: 69.23,48.89 69.27,48.86 U$1.5
  Top 0.508: 69.23,48.89 67.59,50.53 67.59,57.62 65.78,59.43 65.78,82 v66.2,82.42
  Bottom 0.508: U4.34 30.24,82.4 66.18,82.4 v66.2,82.42
IO4
  Top 0.508: SV1.4 77.87,96.74 79.1,97.97 90.32,97.97 91.12,97.17 91.12,91.87 92.11,90.88 R16.2
  Route2 0.508: SV1.4 81.72,91.36 94.74,91.36 98.28,87.81 98.28,59.37 97.26,58.36 JP6.5
  Bottom 0.508: U4.32 33.28,80.36 66.5,80.36 68.73,82.59 68.73,96.03 70.65,97.95 75.97,97.95 77.87,96.04 SV1.4
IO5
  Bottom 0.508: U4.29 39.5,78.95 67.46,78.95 70.25,81.75 SV1.1
IO12  (via drill 0.3 pad 1)
  Top 0.305: ADC.24 51.86,48.64 50.72,49.78 v50.72,55.33
  Route2 0.305: U4.13 24.76,82.46 33.09,74.13 55.44,74.13 57.15,72.42 57.15,70.08 56.56,69.49 53.07,69.49 52.82,69.23 v52.82,68.8 | v50.72,55.33 53.56,58.17 66.86,58.17 74.67,65.97 JP6.2
  Bottom 0.305: v52.82,68.8 50.72,66.7 v50.72,55.33
IO14  (via drill 0.3 pad 1)
  Top 0.305: ADC.12 62.69,42 v63.59,42.89
  Route2 0.305: U4.12 27.3,81.58 33.7,75.18 55.87,75.18 57.99,73.07 57.99,69.72 v56.59,68.32 | v63.59,42.89 69.4,48.7 75.4,54.7 75.4,59.73 79.1,63.44 JP6.3
  Bottom 0.305: v63.59,42.89 63,42.3 58.64,42.3 57.8,43.14 57.8,45.64 57.04,46.4 55.99,46.4 55.42,46.97 55.42,67.15 v56.59,68.32
IO15  (via drill 0.3 pad 1)
  Top 0.305: ADC.13 60.7,42.5 61.59,43.39 v61.59,43.61
  Route2 0.305: U4.35 17.14,65.01 21.2,60.95 42.79,60.95 54.27,49.47 54.27,49.03 57.87,45.43 59.77,45.43 v61.59,43.61 61.59,41.89 64.2,39.27 67,39.27 69.36,41.64 69.36,45.52 78.03,54.19 78.03,58.74 80.18,60.9 JP6.4
IO18
  Bottom 0.508: U4.28 40.51,77.43 77.97,77.43 79.27,78.73 79.27,97.26 79.95,97.95 82.26,97.95 82.95,97.25 SV1.6
IO19
  Bottom 0.508: U4.27 41.62,76 78.72,76 80.41,77.7 SV1.5
IO21  (via drill 0.3 pad 1)
  Top 0.508: v4.24,30.43 3.79,29.97 PEXP.15
  Bottom 0.508: v4.24,30.43 4.24,32.5 1.7,35.04 1.7,64.95 5.49,68.74 41.57,68.74 42.54,69.72 U4.25
IO22  (via drill 0.3 pad 1)
  Top 0.508: PEXP.14 5.05,29.21 v6.27,30.43
  Bottom 0.508: v6.27,30.43 6.27,32.26 3.14,35.39 3.14,64.06 6.42,67.33 49.17,67.33 50.12,68.29 50.12,71.8 U4.22
IO23
  Bottom 0.508: U4.21 55.43,74.57 83.15,74.57 85.49,76.91 SV1.7
IO25  (via drill 0.3 pad 1)
  Top 0.305: ADC.8 61.69,40 v62.77,38.91
  Route2 0.305: U4.9 34.92,79.06 37.87,76.12 56.37,76.12 58.81,73.68 58.81,68.15 56.73,66.07 v52.3,66.07
  Bottom 0.305: v62.77,38.91 60.79,40.89 56.81,40.89 55.53,42.17 55.53,44 53.91,45.62 53.91,60.88 52.3,62.48 v52.3,66.07
IO26
  Top 0.508: T3.B 6.96,70.1 7.45,70.59 7.45,89.11 12.84,94.5 31.09,94.5 32.38,95.79 U4.10
IO27  (via drill 0.3 pad 1)
  Top 0.508: v67.34,90.08 85.06,90.08 89.41,85.73 STATUS.4-DIN
  Route2 0.305: U4.11 29.84,91.15 29.85,91.15 29.85,91.14 v29.85,90.08
  Bottom 0.508: v29.85,90.08 v67.34,90.08
IO32  (via drill 0.3 pad 1)
  Top 0.305: v65.55,42.66 65.55,42.31 64.73,41.5 ADC.11
  Route2 0.305: U4.7 40,79.93 41.8,78.13 57.34,78.13 60.43,75.05 60.43,70.52 60.87,70.08 65.33,70.08 v67.1,68.3
  Bottom 0.305: v65.55,42.66 65.55,44.62 66.69,45.77 66.69,67.89 v67.1,68.3
IO33  (via drill 0.3 pad 1)
  Top 0.305: ADC.9 57.79,40.5 | v64.75,40.48 64.73,40.5 57.79,40.5 | ADC.10 57.79,40.5
  Route2 0.305: U4.8 37.46,79.19 39.47,77.18 56.81,77.18 59.63,74.36 59.63,66.74 57.41,64.53 v54.47,64.53
  Bottom 0.305: v64.75,40.48 63.7,41.52 56.96,41.52 56.1,42.38 56.1,44.57 54.47,46.2 v54.47,64.53
IO34
  Route2 0.508: U4.5 47.22,95.11 63.51,95.11 65.93,97.53 71.76,97.53 72.79,96.5 SV1.2
IO35  (via drill 0.3 pad 1)
  Top 0.305: ADC.14 58.97,43 v59.59,43.61
  Route2 0.305: U4.6 42.54,81.29 44.63,79.2 58.24,79.2 61.27,76.17 61.27,72.1 61.8,71.56 v62.19,71.56
  Bottom 0.305: v59.59,43.61 62.18,46.21 63.59,46.21 64.14,46.76 64.14,53.62 63.91,53.85 63.91,58.02 63.97,58.08 63.97,66.15 62.19,67.93 v62.19,71.56
N$3
  Top 0.508: WSS_LED.A 96.62,90.88 R16.1
N$4
  Top 0.508: R3.1 3.52,71.07 | T3.C 3.58,71.07 3.52,71.07 | 3.52,71.07 3.52,69.57 11.13,61.96 LS1.2
N$5
  Top 0.305: ADC.36 44.74,42.5 42.48,44.75 C8.2
N$6
  Top 0.508: WLAN.4-DIN 94.16,79.56 95.05,79.56 STATUS.2-DOUT
N$7
  Top 0.508: C1.1 85.15,33.77 NVO.4
N$10
  Top 0.305: ADC.45 44.76,38 | 44.76,38 43.41,38 C2.2 | ADC.44 45.26,38.5 44.76,38
N$11
  Top 0.305: 85.99,45.8 T5.2 85.99,45.01 86.26,44.74 88.98,44.74 89.67,44.05 89.67,43.39 90.32,42.73 R9.1 90.2,42.08 T8.3 90.2,41.33
N$12
  Top 0.305: U$1.1 IC1.3 | IC1.3
N$13
  Top 0.305: C5.2 42.62,41 ADC.39
N$14
  Top 0.508: D3.2 21.84,41.16 | 21.84,41.16 24.59,41.16 U2.1 | L1.1 19.91,43.09 21.84,41.16
N$15
  Top 0.508: C6.1 24.6,38.61 U2.3
N$16
  Top 0.508: U2.7 32.53,39.86 R2.2 34.95,39.65 R8.2 34.98,45.17 31.75,48.4 L1.2
N$17
  Top 0.508: U2.5 R1.2 28.28,34.71 R7.1
N$18
  Top 0.508: U2.8 32.53,41.13 R2.1
N$19
  Top 0.508: R1.1 R11.2 17.6,33.2 D3.1 16.84,37.76 12.94,41.66 C14.+
N$20
  Top 0.305: IC1.7 IC1.6
N$21
  Top 0.305: R5.2 T1.1 76.04,41.92 76.31,42.19 76.31,43.01 77.82,44.51 81.38,44.51 81.9,44 T7.1
N$22
  Top 0.508: C1.2 86.03,35.81 86.53,36.31 NVO.2
N$23
  Top 0.406: R12.1 XLED1.A
N$24
  Top 0.406: R13.1 27.39,2.78 XLED2.A
N$26
  Top 0.508: R17.1 26.94,20.09 26.98,20.05 U5.2 U5.4
N$27
  Top 0.508: U5.1 26.62,22.51 29.36,25.26 R37.2
N$28
  Top 0.508: U6.2 47.3,20.05 | 47.3,20.05 U6.4 | R20.1 47.28,20.07 47.3,20.05
N$29
  Top 0.508: R19.2 49.73,24.94 47.13,22.34 U6.1
N$30
  Top 0.305: C4.2 42.87,39.5 ADC.42
N$31
  Top 0.508: U7.4 U7.2 64.22,20.05 R22.1
N$32
  Top 0.508: U7.1 67.66,22.34 70.16,24.84 R21.2
N$33
  Top 0.406: R14.1 47.87,2.86 XLED3.A
N$34
  Top 0.508: U8.4 U8.2 87.82,20.07 R24.1
N$35
  Top 0.508: U8.1 87.83,22.41 90.6,25.18 R23.2
N$36
  Top 0.406: R15.1 XLED4.A
OS_0  (via drill 0.3 pad 1)
  Top 0.305: ADC.3 57.3,37.48 58.31,37.48 59.45,36.34 66.06,36.34 68.58,38.85 68.58,44.04 65.38,47.23 v65.28,47.23
  Route2 0.305: v65.28,47.23 65.28,47.29 63.39,49.18 60.98,49.18 60.03,48.23 OS_0.2
OS_1
  Top 0.305: ADC.4 58.52,38 59.72,36.8 65.76,36.8 68.01,39.05 68.01,43.6 66.18,45.43 63.13,45.43 61.42,47.14 61.42,50.05 OS_1.2
OS_2
  Top 0.305: ADC.5 58.82,38.5 60.05,37.27 65.47,37.27 67.36,39.16 67.36,43.39 65.93,44.82 60.58,44.82 58.83,46.57 58.83,53.5 OS_2.2
RXD0  (via drill 0.3 pad 1)
  Top 0.508: v68.19,61.16 81.19,61.16 89.08,53.27 JP6.7
  Route2 0.508: U4.24 45.08,64.54 48.47,61.16 v68.19,61.16
SEN1
  Top 0.508: X1.1 17.98,14.14 17.98,18.64 17.98,18.69 | 17.98,18.69 JP1.2 | C16.1 17.41,19.27 17.98,18.69
SEN2
  Top 0.508: JP2.2 38.48,18.69 | X2.1 38.48,14.14 38.48,17.74 38.48,18.69 | C17.1 38.48,18.69
SEN3
  Top 0.508: JP3.2 58.98,18.36 | X3.1 58.98,14.14 58.98,17.79 58.98,18.36 | C18.1 58.98,18.36
SEN4
  Top 0.508: JP4.2 79.5,18.44 | X4.1 79.5,17.66 79.5,18.44 | C19.1 79.5,18.44
SICP1
  Top 0.508: JP1.1 21.27,24.57 SW1.1
SICP2
  Top 0.508: JP2.1 41.64,24.57 SW2.1
SICP3
  Top 0.508: JP3.1 62.14,24.57 SW3.1
SICP4
  Top 0.508: JP4.1 82.33,24.57 SW4.1
TP2
  Top 0.305: R4.1 75.54,45.94 75.54,43.74 T1.2 | U$1.6 75.58,46.76 75.58,46.05 R4.1 | R4.1 81.69,46.02 82.53,46.86 IC1.5
TP4-TEDS  (via drill 0.3 pad 1)
  Top 0.305: R6.2 83.27,40.03 T7.2 84.02,41.35 | 84.02,41.35 T8.1 | 84.02,41.35 85.18,40.19 v85.18,40.16
  Top 0.406: SW1.8 22.38,30.35 23.31,31.29 32.47,31.29 v32.8,30.97
  Top 0.508: SW2.8 42.74,30.6 43.36,31.21 49.51,31.21 v50.25,31.95 | SW3.8 63.16,30.65 62.88,30.94 v60.96,30.94 | SW4.8 83.61,30.6 v81.56,32.65 | v64.26,33.13 68.22,33.13 v68.26,33.17
  Route2 0.508: v68.26,33.17 68.77,32.65 v81.56,32.65 81.56,36.54 v85.18,40.16 | v64.26,33.13 64.26,32.38 62.83,30.95 60.97,30.95 v60.96,30.94 57.81,30.94 56.79,31.95 v50.25,31.95 33.78,31.95 v32.8,30.97
TP6
  Top 0.305: IC1.2 IC1.1 80.67,50.09 86.83,50.09 87.33,49.6 87.33,46.3 T5.3 R10.1
TXD0  (via drill 0.3 pad 1)
  Top 0.508: v68.19,63.18 82.81,63.18 90.26,55.73 95.76,55.73 JP6.6
  Route2 0.508: U4.23 47.62,63.66 48.1,63.18 v68.19,63.18
V-  (via drill 0.3 pad 1)
  Top 0.305: C7.2 v96.39,31.83 | R5.1 81.25,38.26 R6.1 | NVO.5 92.94,33.19 91.95,32.21 84.39,32.21 82.12,34.47 R6.1 | R6.1 84.04,37.38 86.11,39.45 T8.2
  Top 0.406: SW1.7 23,29.7 23,29.08 21.99,28.07 v20.65,28.07 | SW2.7 43.4,29.03 42.54,28.17 v40.92,28.17 | SW3.7 63.79,29.7 63.79,29.08 62.86,28.14 v61.36,28.14 | SW4.7 84.23,29.7 84.23,29.08 83.3,28.14 v81.86,28.14
  Top 0.508: NVO.5 C7.2 | v96.39,31.83 96.39,24.09 97.27,23.21 97.27,17.64 JP5.1
  Route2 0.406: v96.39,31.83 92.62,28.05 86.59,28.05 85.7,28.94 84.63,28.94 83.83,28.14 v81.86,28.14 81.52,27.8 66.5,27.8 65.58,28.71 61.93,28.71 v61.36,28.14 60.97,27.75 46.02,27.75 44.96,28.81 41.56,28.81 v40.92,28.17 26.46,28.17 26.44,28.15 25.2,28.15 24.38,28.97 21.55,28.97 v20.65,28.07
XLED1  (via drill 0.3 pad 1, 0.3 pad 1.5)
  Top 0.406: v5.53,8.2 5.53,8.16 R12.2
  Top 0.508: PEXP.9 11.88,28.4 v13.05,28.4
  Route2 0.406: v13.05,28.4 13.05,19.41 10.62,16.98 8.26,16.98 7.44,16.17 7.44,9.51 6.13,8.2 v5.53,8.2
XLED2  (via drill 0.3 pad 1, 0.3 pad 1.5)
  Top 0.406: v3.38,8.2 4.69,9.51 6.1,9.51 9.82,5.8 28.61,5.8 29.09,5.31 R13.2
  Top 0.508: PEXP.10 10.13,28.69 11.88,30.43 v12.37,30.43
  Route2 0.406: v12.37,30.43 10.79,28.86 10.79,26.48 12.34,24.93 12.34,20.1 11.25,19.01 7.54,19.01 6.55,18.02 6.55,10.33 4.42,8.2 v3.38,8.2
XLED3  (via drill 0.3 pad 1, 0.3 pad 1.5)
  Top 0.406: v2.08,10.38 6.1,10.38 9.99,6.49 47.79,6.49 R14.2
  Top 0.508: PEXP.11 8.87,28.96 v10.34,30.43
  Route2 0.406: v10.34,30.43 10.34,30.36 3.26,23.28 3.26,19.16 4.23,18.18 4.23,11.96 2.65,10.38 v2.08,10.38
XLED4  (via drill 0.3 pad 1, 0.3 pad 1.5)
  Top 0.406: v15.87,17.24 15.87,12.84 16.66,12.05 68.22,12.05 70.12,10.16 R15.2
  Top 0.508: PEXP.12 7.59,29.72 v8.3,30.43
  Route2 0.406: v8.3,30.43 9.62,31.75 13.64,31.75 14.23,31.16 14.23,20.78 15.87,19.13 v15.87,17.24
XSEN1  (via drill 0.3 pad 1)
  Top 0.406: v20.65,26.01 20.7,26.01 23.67,28.98 SW1.6
  Top 0.508: v4.8,20.78 6.33,19.25 PEXP.4 6.33,16.27 RPD3.2
  Bottom 0.406: v4.8,20.78 4.8,22.87 6.38,24.45 15.6,24.45 16.31,25.16 16.31,25.54 16.79,26.02 20.64,26.02 v20.65,26.01
XSEN2  (via drill 0.3 pad 1)
  Top 0.406: v40.92,26.14 41.22,26.14 44.04,28.95 SW2.6
  Top 0.508: v6.83,22.25 7.59,21.49 PEXP.5 7.59,14.79 6.82,14.01 RPD2.2
  Bottom 0.406: v6.83,22.25 7.79,23.21 9.26,23.21 9.27,23.2 14.22,23.2 17.22,20.2 34.39,20.2 35.76,21.58 35.76,25.18 36.72,26.14 v40.92,26.14
XSEN3  (via drill 0.3 pad 1)
  Top 0.406: v61.36,26.11 61.54,26.11 64.46,29.03 SW3.6
  Top 0.508: v8.86,22.25 v8.87,22.25 PEXP.6 8.87,15.87 RPD1.2
  Bottom 0.406: v8.86,22.25 13.88,22.25 16.66,19.47 54.18,19.47 56.39,21.68 56.39,25.16 57.34,26.11 v61.36,26.11
XSEN4  (via drill 0.3 pad 1)
  Top 0.406: v81.86,26.11 81.99,26.11 84.91,29.03 SW4.6
  Top 0.508: v10.89,20.75 10.13,19.99 PEXP.7 10.13,13.35 8.71,11.92 2.85,11.92 RPD.2
  Bottom 0.406: v10.89,20.75 13.88,20.75 15.9,18.73 75.26,18.73 77.14,20.61 77.14,25.69 77.56,26.11 v81.86,26.11

## Text on the board
tPlace: OASIS | Open Acquisition System | for IEPE Sensors | 1 | 0 | Ch. 1 | Ch. 2 | Ch. 3 | Ch. 4